# Altium schematic sheet KlokWave.Klok.SchDoc
size A4; SheetNumber: 1; SheetTotal: 3
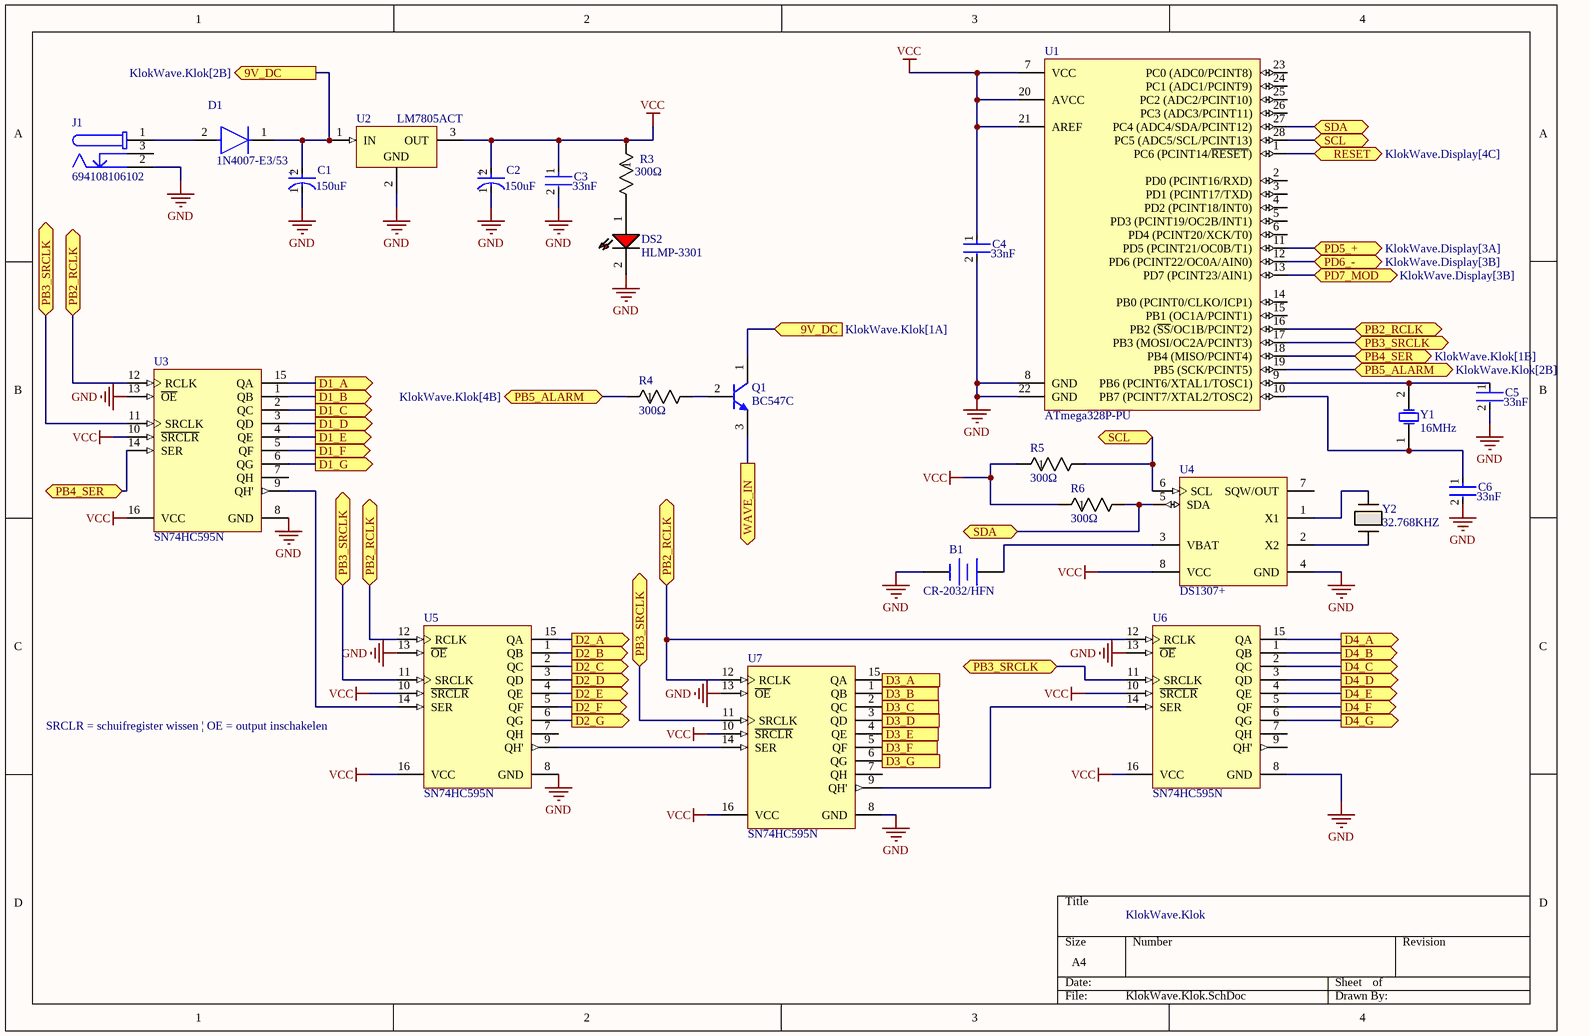
[diagram p0: KlokWave.Klok.SchDoc]

## Parts
B1  CR-2032/HFN  [THT 3VBAT: PANA-CR-2032HFN]
C1  Capacitance: 150uF  [THT PolCondensator FP-OS-CON-TH-E7-d_0_45-MFG]  (hidden comment: 16SEPC150MD)
C2  Capacitance: 150uF  [THT PolCondensator FP-OS-CON-TH-E7-d_0_45-MFG]  (hidden comment: 16SEPC150MD)
C3  Capacitance: 33nF  [THT NonPol CerCOndensator: FP-565R30GASS33-MFG]  (hidden comment: 565R30GASS33)
C4  Capacitance: 33nF  [THT NonPol CerCOndensator: FP-565R30GASS33-MFG]  (hidden comment: 565R30GASS33)
C5  Capacitance: 33nF  [THT NonPol CerCOndensator: FP-565R30GASS33-MFG]  (hidden comment: 565R30GASS33)
C6  Capacitance: 33nF  [THT NonPol CerCOndensator: FP-565R30GASS33-MFG]  (hidden comment: 565R30GASS33)
D1  1N4007-E3/53  [THT Diode FP-1N4007-E3-53-MFG]
DS2  HLMP-3301  [THT LED: AVAG-HLMP-3301-2]
J1  694108106102  [THT DC Power Jack: 694106301002]
Q1  BC547C  [THT NPN Transistor: ONSC-TO-92-3-29-11_AM_BL]
R3  Resistance: 300Ω  [THT Resistor: RES_AC03_VIS]  (hidden comment: AC03000003000JAC00)
R4  Resistance: 300Ω  [THT Resistor: RES_AC03_VIS]  (hidden comment: AC03000003000JAC00)
R5  Resistance: 300Ω  [THT Resistor: RES_AC03_VIS]  (hidden comment: AC03000003000JAC00)
R6  Resistance: 300Ω  [THT Resistor: RES_AC03_VIS]  (hidden comment: AC03000003000JAC00)
U1  ATmega328P-PU  [THT ATMEGA328P-PU: 28P3]
U2  LM7805ACT  [THT LM7805: FAIR-TO-220-3]
U3  SN74HC595N  [THT 74HC595N: N0016A]
U4  DS1307+  [THT Chip DS1307: P8+2]
U5  SN74HC595N  [THT 74HC595N: N0016A]
U6  SN74HC595N  [THT 74HC595N: N0016A]
U7  SN74HC595N  [THT 74HC595N: N0016A]
Y1  16MHz  [THT 16 MHz: WE-XTAL_HC49/4H]
Y2  32.768KHZ  [THT 32 KHz OSC: XTAL_AB38T_ABR]

## Ports
9V_DC (in, see KlokWave.Klok[1A]), 9V_DC (out, see KlokWave.Klok[2B]), D1_A (out, see KlokWave.Display[2A]), D1_B (out, see KlokWave.Display[2A]), D1_C (out, see KlokWave.Display[2A]), D1_D (out, see KlokWave.Display[2A]), D1_E (out, see KlokWave.Display[2A]), D1_F (out, see KlokWave.Display[2A]), D1_G (out, see KlokWave.Display[2A]), D2_A (out, see KlokWave.Display[2B]), D2_B (out, see KlokWave.Display[2B]), D2_C (out, see KlokWave.Display[2B]), D2_D (out, see KlokWave.Display[2B]), D2_E (out, see KlokWave.Display[2B]), D2_F (out, see KlokWave.Display[2B]), D2_G (out, see KlokWave.Display[2B]), D3_A (out, see KlokWave.Display[2C]), D3_B (out, see KlokWave.Display[2C]), D3_C (out, see KlokWave.Display[2C]), D3_D (out, see KlokWave.Display[2C]), D3_E (out, see KlokWave.Display[2C]), D3_F (out, see KlokWave.Display[2C]), D3_G (out, see KlokWave.Display[2C]), D4_A (out, see KlokWave.Display[2C]), D4_B (out, see KlokWave.Display[2C]), D4_C (out, see KlokWave.Display[2C]), D4_D (out, see KlokWave.Display[2D]), D4_E (out, see KlokWave.Display[2D]), D4_F (out, see KlokWave.Display[2D]), D4_G (out, see KlokWave.Display[2D]), PB2_RCLK (bidir, see KlokWave.Klok[1B], KlokWave.Klok[1C], KlokWave.Klok[2C]), PB2_RCLK (bidir, see KlokWave.Klok[1B], KlokWave.Klok[1C], KlokWave.Klok[4B]), PB2_RCLK (bidir, see KlokWave.Klok[1B], KlokWave.Klok[2C], KlokWave.Klok[4B]), PB2_RCLK (bidir, see KlokWave.Klok[1C], KlokWave.Klok[2C], KlokWave.Klok[4B]), PB3_SRCLK (bidir, see KlokWave.Klok[1B], KlokWave.Klok[1C], KlokWave.Klok[2C], KlokWave.Klok[3C]), PB3_SRCLK (bidir, see KlokWave.Klok[1B], KlokWave.Klok[1C], KlokWave.Klok[2C], KlokWave.Klok[4B]), PB3_SRCLK (bidir, see KlokWave.Klok[1B], KlokWave.Klok[1C], KlokWave.Klok[3C], KlokWave.Klok[4B]), PB3_SRCLK (bidir, see KlokWave.Klok[1B], KlokWave.Klok[2C], KlokWave.Klok[3C], KlokWave.Klok[4B]), PB3_SRCLK (bidir, see KlokWave.Klok[1C], KlokWave.Klok[2C], KlokWave.Klok[3C], KlokWave.Klok[4B]), PB4_SER (bidir, see KlokWave.Klok[1B]), PB4_SER (bidir, see KlokWave.Klok[4B]), PB5_ALARM (bidir, see KlokWave.Klok[2B]), PB5_ALARM (bidir, see KlokWave.Klok[4B]), PD5_+ (bidir, see KlokWave.Display[3A]), PD6_- (bidir, see KlokWave.Display[3B]), PD7_MOD (bidir, see KlokWave.Display[3B]), RESET (bidir, see KlokWave.Display[4C]), SCL (bidir, see KlokWave.Klok[3B]), SCL (bidir, see KlokWave.Klok[4A]), SDA (bidir, see KlokWave.Klok[3C]), SDA (bidir, see KlokWave.Klok[4A]), WAVE_IN (out, see KlokWave.Wave[4A])

## Nets
GND: B1.2(-) C1.1(C) C2.1(C) C3.2 C4.2 C5.2 C6.2 DS2.2(A) J1.2 U1.8(GND) U1.22(GND) U2.2(GND) U3.8(GND) U3.13(~{OE}) U4.4(GND) U5.8(GND) U5.13(~{OE}) U6.8(GND) U6.13(~{OE}) U7.8(GND) U7.13(~{OE})
VCC: C2.2(A) C3.1 C4.1 R3.1 R5.1 R6.1 U1.7(VCC) U1.20(AVCC) U1.21(AREF) U2.3(OUT) U3.10(~{SRCLR}) U3.16(VCC) U4.8(VCC) U5.10(~{SRCLR}) U5.16(VCC) U6.10(~{SRCLR}) U6.16(VCC) U7.10(~{SRCLR}) U7.16(VCC)
9V_DC: C1.2(A) D1.1(C) Q1.1(C) U2.1(IN) ; port 9V_DC
D1_A: U3.15(QA) ; port D1_A
D1_B: U3.1(QB) ; port D1_B
D1_C: U3.2(QC) ; port D1_C
D1_D: U3.3(QD) ; port D1_D
D1_E: U3.4(QE) ; port D1_E
D1_F: U3.5(QF) ; port D1_F
D1_G: U3.6(QG) ; port D1_G
D2_A: U5.15(QA) ; port D2_A
D2_B: U5.1(QB) ; port D2_B
D2_C: U5.2(QC) ; port D2_C
D2_D: U5.3(QD) ; port D2_D
D2_E: U5.4(QE) ; port D2_E
D2_F: U5.5(QF) ; port D2_F
D2_G: U5.6(QG) ; port D2_G
D3_A: U7.15(QA) ; port D3_A
D3_B: U7.1(QB) ; port D3_B
D3_C: U7.2(QC) ; port D3_C
D3_D: U7.3(QD) ; port D3_D
D3_E: U7.4(QE) ; port D3_E
D3_F: U7.5(QF) ; port D3_F
D3_G: U7.6(QG) ; port D3_G
D4_A: U6.15(QA) ; port D4_A
D4_B: U6.1(QB) ; port D4_B
D4_C: U6.2(QC) ; port D4_C
D4_D: U6.3(QD) ; port D4_D
D4_E: U6.4(QE) ; port D4_E
D4_F: U6.5(QF) ; port D4_F
D4_G: U6.6(QG) ; port D4_G
PB2_RCLK: U1.16(PB2_(~{SS}/OC1B/PCINT2)) U3.12(RCLK) U5.12(RCLK) U6.12(RCLK) U7.12(RCLK) ; port PB2_RCLK
PB3_SRCLK: U1.17(PB3_(MOSI/OC2A/PCINT3)) U3.11(SRCLK) U5.11(SRCLK) U6.11(SRCLK) U7.11(SRCLK) ; port PB3_SRCLK
PB4_SER: U1.18(PB4_(MISO/PCINT4)) U3.14(SER) ; port PB4_SER
PB5_ALARM: R4.1 U1.19(PB5_(SCK/PCINT5)) ; port PB5_ALARM
PD5_+: U1.11(PD5_(PCINT21/OC0B/T1)) ; port PD5_+
PD6_-: U1.12(PD6_(PCINT22/OC0A/AIN0)) ; port PD6_-
PD7_MOD: U1.13(PD7_(PCINT23/AIN1)) ; port PD7_MOD
RESET: U1.1(PC6_(PCINT14/~{RESET})) ; port RESET
SCL: R5.2 U1.28(PC5_(ADC5/SCL/PCINT13)) U4.6(SCL) ; port SCL
SDA: R6.2 U1.27(PC4_(ADC4/SDA/PCINT12)) U4.5(SDA) ; port SDA
WAVE_IN: Q1.3(E) ; port WAVE_IN
NetB1_1: B1.1(+) U4.3(VBAT)
NetC5_1: C5.1 U1.9(PB6_(PCINT6/XTAL1/TOSC1)) Y1.2(OSC2)
NetC6_1: C6.1 U1.10(PB7_(PCINT7/XTAL2/TOSC2)) Y1.1(OSC1)
NetD1_2: D1.2(A) J1.1
NetDS2_1: DS2.1(K) R3.2
NetQ1_2: Q1.2(B) R4.2
NetU3_9: U3.9(QH') U5.14(SER)
NetU4_1: U4.1(X1) Y2.1
NetU4_2: U4.2(X2) Y2.2
NetU5_9: U5.9(QH') U7.14(SER)
NetU6_14: U6.14(SER) U7.9(QH')

Not connected (* = marked no-connect by the designer): J1 3; U1 2(PD0_(PCINT16/RXD)) 3(PD1_(PCINT17/TXD)) 4(PD2_(PCINT18/INT0)) 5(PD3_(PCINT19/OC2B/INT1)) 6(PD4_(PCINT20/XCK/T0)) 14(PB0_(PCINT0/CLKO/ICP1)) 15(PB1_(OC1A/PCINT1)) 23(PC0_(ADC0/PCINT8)) 24(PC1_(ADC1/PCINT9)) 25(PC2_(ADC2/PCINT10)) 26(PC3_(ADC3/PCINT11)); U3 7(QH); U4 7(SQW/OUT); U5 7(QH); U6 7(QH) 9(QH'); U7 7(QH)

## Notes on the sheet
- (near U5) SRCLR = schuifregister wissen | OE = output inschakelen
- KlokWave.Klok
- (in symbol CMP-05428-000489-1) +

## Library data of the parts
B1 = CMP-2000-05296-1: Coin Cell Battery, 225 mAh, 0.2 mA, 3 V, -30 to 60 degC, Bulk; Manufacturer: Panasonic; SVHC: 1,2-dimethoxyethane,ethyleneglycoldimethylether(EGDME)(15-Jun-2015); Battery Size Code: 2032; Battery Voltage: 3V; Battery IEC Code: CR2032; Battery NEDA Code: 5004LC; External Height: 3.2mm; Battery Terminals: PCBPins; Battery Capacity: 220mAh; External Diameter: 20mm; Battery Technology: LithiumManganeseDioxide; Product Range: -; Datasheet Version: Rev. 0, 05/2010; Manufacturer URL: http://www.panasonic.com/; External Depth: -; Weight: 2.9g; Datasheet URL: https://datasheet.ciiva.com/3/aaa4000de87-3072.pdf; External Width: -
C1 C2 = CMP-05428-000489-1: Conductive Polymer Aluminum Solid Capacitors (OS-CON) 150uF ±20% 16V RADIAL TH 8x7mm; Ripple Current: 3.22A; ESR (Equivalent Series Resistance): 22mR; Polarity: Polar; Leakage Current: 500uA; Dissipation Factor: 12%; Life (Hours): 5000Hour; Lead Diameter: 0.45mm; Voltage Rating: 16V; Case/Package: Radial; Mount: Through Hole; Series: OS-CON™, SEPC; Lead Pitch: 3.5mm; Height - Seated (Max): 0.276inch; Diameter: 8mm; Max Operating Temperature: 105°C; Length: 7mm; Voltage Rating (DC): 16V; Lead Free: Lead Free; RoHS Compliant: Yes; Package Quantity: 200; Voltage: 16V; Packaging: Bulk; Tolerance: 20%; REACH SVHC: No SVHC; Termination: Radial; Number of Pins: 7; Min Operating Temperature: -55°C; Height: 7mm
C3-C6 = CMP-00030-41968055-1: 565R30GASS33 33nF 3 kV dc THT Ceramic Single Layer Capacitor; Z5U Dielectric Radial 565R Series; Voltage: 3kV; Tolerance: 20%; Lead Diameter: 640µm; Diameter: 22.9mm; Lead Free: Lead Free; Material: Ceramic; Schedule B: 8532230060; Depth: 6.1mm; Mount: Radial; Max Operating Temperature: 105°C; Composition: Ceramic; RoHS: Compliant; Min Operating Temperature: -25°C; Dielectric: Z5U; NexarPartId: 41968055; Height: 22.9mm; Voltage Rating: 3kV; Lead Pitch: 9.52mm; Termination: Radial; Packaging: Bulk; Case/Package: Radial; Voltage Rating (DC): 3kV
D1 = CMP-02540-000066-1: 1N4007 DIODE GEN PURP 1KV 1A DO204AL; Max Surge Current: 45A; Max Reverse Current: 5uA; Element Configuration: Single; Max Repetitive Reverse Voltage (Vrrm): 1kV; Max Reverse Voltage (DC): 1kV; Packaging: Tape and Reel; Peak Non-Repetitive Surge Current: 45A; Reverse Voltage: 1kV; Number of Pins: 2; Contact Plating: Tin; Mount: Through Hole; Package Quantity: 3000; Case/Package: DO-41; Radiation Hardening: No; Max Operating Temperature: 150°C; Series: -; Min Operating Temperature: -50°C; Average Rectified Current: 1A
DS2 = CMP-2000-06411-1: T-1 3/4 (5 mm) Diffused LED Lamp, 1.9 V, -40 to 100 degC, 2-Pin THD; Manufacturer: Avago; Forward Current: 25mA; Forward Voltage: 2.4V; Peak Wavelength: 635nm; Shape Type: Circular; High Brightness: No; Main Category: StandardLED; Test Current (It): 10mA; Dominant Wave Length: 626nm; Number of  Elements: 1; Reverse Voltage: 5V; Chip Material: GaP; Product Height (mm): 9.19mm; Lens Type: ColoredDiffused; Viewing Angle: 60deg; Type: Uni-Color; Emitting Color: Red; Luminous Intensity: 5.4mcd; Power Dissipation: 85W; DELETED: Compliant; Product Depth (mm): 6.1mm; Package Description: 2-Pin Through Hole LED, Dia 5.85 mm; Mounting Technology: ThroughHole; Manufacturer URL: http://www.avagotech.com/; Package Type: T-13/4; Operating Temp Range: -40Cto100C; Datasheet URL: http://www.avagotech.com/docs/AV02-1558EN; Mounting: ThroughHole; Lens Dimensions: 5.08x5.08x8.3mm; Package Reference: HLMP-3301; Datasheet Version: 03/2015; Pin Count: 2; Packaging: TapeandReel; Operating Temperature Classification: Industrial; Lum Intensity: 5.4mcd; Rad Hardened: No; Product Length (mm): 6.1mm
J1 = CMP-1502-00180-2: DC Power JAck; NexarPartId: 52645186; Shielding: Unshielded; Voltage Rating: 24V; Insulation Resistance: 100MΩ; Current Rating: 5A; Gender: Male; RoHS: Compliant; Housing Material: Polyamide; Connector Type: Power; Flammability Rating: UL94 V-0; Contact Gender: Female; Mount: Surface Mount; Termination: SMD/SMT; Contact Plating: Tin; Max Operating Temperature: 85°C; Operating Supply Voltage: 24V; Voltage Rating (DC): 24V; REACH SVHC: Unknown; Packaging: Tape and Reel; Min Operating Temperature: -40°C; Color: Black
Q1 = CMP-1048-01437-1: BC547C: THT Amplifier Transistor, NPN Silicon, 3-Pin TO-92, Bulk Box; Manufacturer: On Semiconductor; IC Continuous (A): 0.1; fT Min (MHz): 150; Mounting Technology: Through Hole; ComponentLink1URL: http://www.onsemi.com/; ComponentLink1Description: Manufacturer URL; ComponentLink3URL: http://www.onsemi.cn/pub_link/Collateral/2N6426-D.PDF; DatasheetVersion: Rev. 7; PackageVersion: Rev. AM; Packing: Bulk Box; RoHS: FALSE; Polarity: NPN; PartNumber: BC547C; ComponentLink2URL: http://www.onsemi.com/pub_link/Collateral/BC546-D.PDF; ComponentLink3Description: Package Specification; PackageDescription: 3-Pin Transistor Outline, Body 4.825 x 3.685 mm, Pitch 1.27 mm; PackageReference: TO-92-3-29-11_AM_SL; ComponentLink2Description: Datasheet
R3-R6 = CMP-00030-39746760-1: AC03000003000JAC00 Res Wirewound THT; Voltage Rating (DC): 30V; Lead Diameter: 800µm; Max Power Dissipation: 3W; Tolerance: 5%; Temperature Coefficient: -80ppm/°C; Max Operating Temperature: 275°C; Number of Pins: 2; Termination: Axial; Diameter: 4.8mm; Contact Plating: Tin; Packaging: Cut Tape (CT); Schedule B: 8533210080, 8533210080|8533210080|8533210080|8533210080|8533210080; Voltage Rating: 30V; Military Standard: Not; Composition: Wirewound; Power Rating: 3W; NexarPartId: 39746760; Case/Package: Axial; REACH SVHC: Unknown; Min Operating Temperature: -40°C; Thickness: 4.8006mm; Features: Flame Retardant Coating; Width: 4.8mm; Length: 13mm; RoHS: Compliant; Number of Terminations: 2
U1 = CMP-0095-00013-2: 8-bit AVR Microcontroller, 32KB Flash, 1KB EEPROM, 2KB SRAM, 28-pin PDIP, Industrial Grade (-40°C to 85°C); RevisionNote: DatasheetVersion updated. URLs added.; PackageVersion: revB, Sep-2001; PackageDescription: 28-lead (0.300"/7.62mm Wide) Plastic Dual Inline Package (PDIP); DatasheetVersion: revD, May-2011; ComponentLink1Description: Manufacturer URL; ComponentLink1URL: http://www.atmel.com/; PackageReference: 28P3; ComponentLink2Description: ATmega48A/48PA/88A/88PA/168A/168PA/328/328P Datasheet; ComponentLink3URL: http://www.atmel.com/dyn/resources/prod_documents/8271S.pdf; ComponentLink2URL: http://www.atmel.com/dyn/resources/prod_documents/8271.pdf; ComponentLink3Description: ATmega48A/48PA/88A/88PA/168A/168PA/328/328P Summary
U2 = CMP-2000-04937-1: Positive Voltage Regulator, 5 V, 1 A, 0 to 125 degC, 3-Pin TO-220, RoHS, Tube; Manufacturer: Fairchild; Number of Outputs: 1; Typical Dropout Voltage @ Current: 2V@1A; Output Type: Fixed; Output Voltage: 5V; Quiescent Current: 6mA; Dropout Voltage Measurement Current: 1A; Line Regulation: 50mV; Maximum Input Voltage: 35V; Regulator Function: Linear; Load Regulation: 100mV; Package Type: TO-220; Mounting Type: ThroughHole; Height: 16.51mm; Maximum Operating Temperature: +125degC; Datasheet Version: Rev. 1.0.1, 05/2006; Package Reference: TO-220; Minimum Operating Temperature: 0degC; Manufacturer URL: https://www.fairchildsemi.com/; Package URL: https://www.fairchildsemi.com/package-drawings/TO/TO220B03.pdf; Length: 10.67mm; Series: LM78xx; Dimensions: 10.67x4.83x16.51mm; Polarity: Positive; Maximum Output Current: 1A; Pin Count: 3; Width: 4.83mm; Package Description: 3-Pin Through Hole Device, Body 10 x 4.5 mm, Pitch 2.54 mm; Datasheet URL: https://datasheet.ciiva.com/5816/1359194-5816420.pdf
U3 U5-U7 = CMP-0780-00137-3: 8-Bit Shift Registers With 3-State Output Registers, N0016A, TUBE; Manufacturer: Texas Instruments; F @ Nom Voltage(Max)(Mhz): 28; Input Type: CMOS; Bits: 8; VCC(Min)(V): 2; 3-State Output: Yes; ICC @ Nom Voltage(Max)(mA): 0.08; VCC(Max)(V): 6; tpd @ Nom Voltage(Max)(ns): 34; Rating: Military; Technology Family: HC; Output Drive (IOL/IOH)(Max)(mA): 7.8/-7.8; Code_JEDEC: MS-001; Output Type: CMOS; Operating Temperature Range(C): -40 to 85; Voltage(Nom)(V): 6; Generic Part Number: SN74HC595; DatasheetVersion: SCLS041H; PackageReference: N0016A; PackageVersion: http://www.ti.com/lit/ml/mpdi002c/mpdi002c.pdf
U4 = CMP-0254-00152-1: 64 x 8, Serial, I2C Real-Time Clock, 5.0V, 8-Pin PDIP, 0 to 70 degC, Pb-Free; ComponentLink2URL: http://datasheets.maxim-ic.com/en/ds/DS1307.pdf; ComponentLink3URL: http://pdfserv.maxim-ic.com/package_dwgs/21-0043.PDF; ComponentLink1Description: Manufacturer URL; PackageVersion: revE, 2011; ComponentLink1URL: http://www.maxim-ic.com; PackageDescription: 8-Pin Plastic Dual-In-Line, Narrow (0.3in), Pitch 2.54 mm, PDIP(N), Pb-Free; ComponentLink2Description: Datasheet; Code_JEDEC: MS-001-AB; PackageReference: P8+2; DatasheetVersion: 10-Feb-2008; ComponentLink3Description: Package Specification
Y1 = 830003240B: THT Quartz Crystal, HC49/4H, 16MHz, +/-30ppm WE-XTAL; Manufacturer: Wurth Elektronik; Frequency Stability: +/-50ppm; Load Capacitance: 30pF; ComponentLink1Description: Website Link; ComponentLink1URL: https://www.we-online.com/redexpert/article/830003240B?ad; ComponentLink2Description: Datasheet Link; ComponentLink2URL: https://www.we-online.com/redexpert/spec/830003240B?ad; Manufacturer Part Number: 830003240B; Category: Crystals; Match Code: WE-XTAL; Mount: Through Hole; Operating Temperature Max: 70°C; Operating Temperature Min: -20°C; Packaging: Bulk; Case/Size Code: HC49/4H; Length: 11.05mm; Width: 4.7mm; Height: 4.1mm; Frequency: 16MHz; Frequency Tolerance: +/-30ppm
Y2 = AB38T-32.768KHZ: THT CRYSTAL 32.7680KHZ 12.5PF TH; Mfr_Name: Abracon